# EAGLE design Schemat1 (EAGLE 9.6.2)
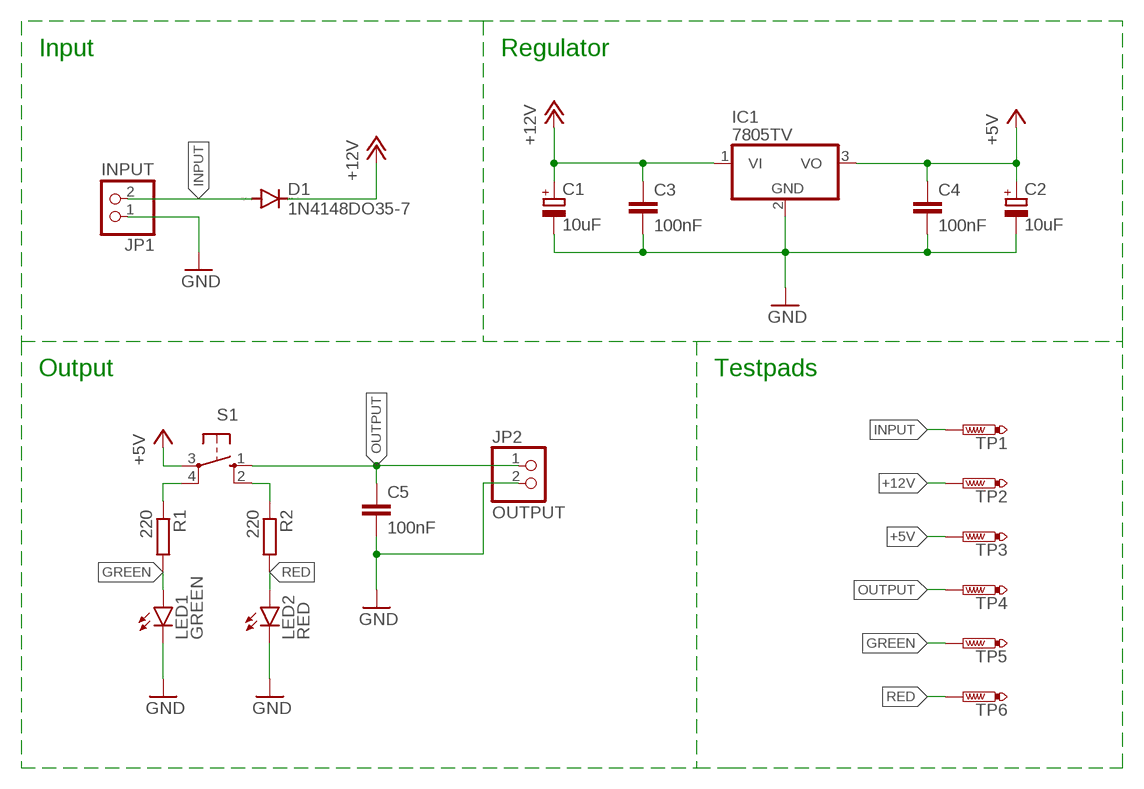
[diagram p0: schematic, sheet 1]

## Parts
C1  10uF  CPOL-EUD  [PANASONIC_D]
C2  10uF  CPOL-EUD  [PANASONIC_D]
C3  100nF  C-EU025-025X050  [C025-025X050]
C4  100nF  C-EU025-025X050  [C025-025X050]
C5  100nF  C-EU025-025X050  [C025-025X050]
D1  1N4148DO35-7  [DO35-7]
IC1  7805TV  [TO220V]
JP1  INPUT  PINHD-1X2  [1X02]
JP2  OUTPUT  PINHD-1X2  [1X02]
LED1  GREEN  LED5MM  [LED5MM]
LED2  RED  LED5MM  [LED5MM]
R1  220  R-EU_0207/10  [0207/10]
R2  220  R-EU_0207/10  [0207/10]
S1  10-XX  [B3F-10XX]
TP1  PTR1TP15R  [TP15R]
TP2  PTR1TP15R  [TP15R]
TP3  PTR1TP15R  [TP15R]
TP4  PTR1TP15R  [TP15R]
TP5  PTR1TP15R  [TP15R]
TP6  PTR1TP15R  [TP15R]

## Nets
+5V: C2.+ C4.1 IC1.3(VO) S1.3(P) TP3.TP
+12V: C1.+ C3.1 D1.C IC1.1(VI) TP2.TP
GND: C1.- C2.- C3.2 C4.2 C5.2 IC1.2(GND) JP1.1 JP2.2 LED1.K(C) LED2.K(C)
GREEN: LED1.A R1.2 TP5.TP
INPUT: D1.A JP1.2 TP1.TP
N$2: R1.1 S1.4(P1)
N$3: R2.1 S1.2(S1)
OUTPUT: C5.1 JP2.1 S1.1(S) TP4.TP
RED: LED2.A R2.2 TP6.TP

## Notes on the sheet
- Input | Regulator
- Output | Testpads

## Library data of the parts
C1 C2 = rcl:CPOL-EU: POLARIZED CAPACITOR, European symbol; SPICEPREFIX: C
C3-C5 = rcl:C-EU: CAPACITOR, European symbol; SPICEPREFIX: C
D1 = diode:1N4148: DIODE high speed (Philips)
IC1 = linear:78*: Positive VOLTAGE REGULATOR Source: http://cache.national.com/ds/LM/LM78L05.pdf http://www.fairchildsemi.com/ds/LM/LM7805.pdf
JP1 JP2 = pinhead:PINHD-1X2: PIN HEADER
LED1 LED2 = led:LED: LED OSRAM: - CHIPLED LG R971, LG N971, LY N971, LG Q971, LY Q971, LO R971, LY R971 LH N974, LH R974 LS Q976, LO Q976, LY Q976 LO Q996 - Hyper CHIPLED LW Q18S LB Q993, LB Q99A, LB R99A - SideLED LS A670, LO A670, LY A670, LG A670, LP A670 LB A673, LV A673, LT A673, LW A673 LH A674 LY A675 LS A676, LA A676, LO A676, LY A676, LW A676 LS A679, LY A679, LG A679 - Hyper Micro SIDELED® LS Y876, LA Y876, LO Y876, LY Y876 LT Y87S - SmartLED LW L88C, LW L88S LB L89C, LB L89S, LG L890 LS L89K, LO L89K, LY L89K LS L896, LA L896, LO L896, LY L896 - TOPLED LS T670, LO T670, LY T670, LG T670, LP T670 LSG T670, LSP T670, LSY T670, LOP T670, LYG T670 LG T671, LOG T671, LSG T671 LB T673, LV T673, LT T673, LW T673 LH T674 LS T676, LA T676, LO T676, LY T676, LB T676, LH T676, LSB T676, LW T676 LB T67C, LV T67C, LT T67C, LS T67K, LO T67K, LY T67K, LW E67C LS E67B, LA E67B, LO E67B, LY E67B, LB E67C, LV E67C, LT E67C LW T67C LS T679, LY T679, LG T679 LS T770, LO T770, LY T770, LG T770, LP T770 LB T773, LV T773, LT T773, LW T773 LH T774 LS E675, LA E675, LY E675, LS T675 LS T776, LA T776, LO T776, LY T776, LB T776 LHGB T686 LT T68C, LB T68C - Hyper Mini TOPLED® LB M676 - Mini TOPLED Santana® LG M470 LS M47K, LO M47K, LY M47K Source: http://www.osram.convergy.de LUXEON: - LUMILED® LXK2-PW12-R00, LXK2-PW12-S00, LXK2-PW14-U00, LXK2-PW14-V00 LXK2-PM12-R00, LXK2-PM12-S00, LXK2-PM14-U00 LXK2-PE12-Q00, LXK2-PE12-R00, LXK2-PE12-S00, LXK2-PE14-T00, LXK2-PE14-U00 LXK2-PB12-K00, LXK2-PB12-L00, LXK2-PB12-M00, LXK2-PB14-N00, LXK2-PB14-P00, LXK2-PB14-Q00 LXK2-PR12-L00, LXK2-PR12-M00, LXK2-PR14-Q00, LXK2-PR14-R00 LXK2-PD12-Q00, LXK2-PD12-R00, LXK2-PD12-S00 LXK2-PH12-R00, LXK2-PH12-S00 LXK2-PL12-P00, LXK2-PL12-Q00, LXK2-PL12-R00 Source: www.luxeon.com KINGBRIGHT: KA-3528ASYC Source: www.kingbright.com
R1 R2 = rcl:R-EU_: RESISTOR, European symbol; SPICEPREFIX: R
S1 = switch-omron:10-XX: OMRON SWITCH; MPN: B3F-1000; OC_FARNELL: 176432; OC_NEWARK: 36M3542
TP1-TP6 = testpad:PTR1: TEST PIN

## Board
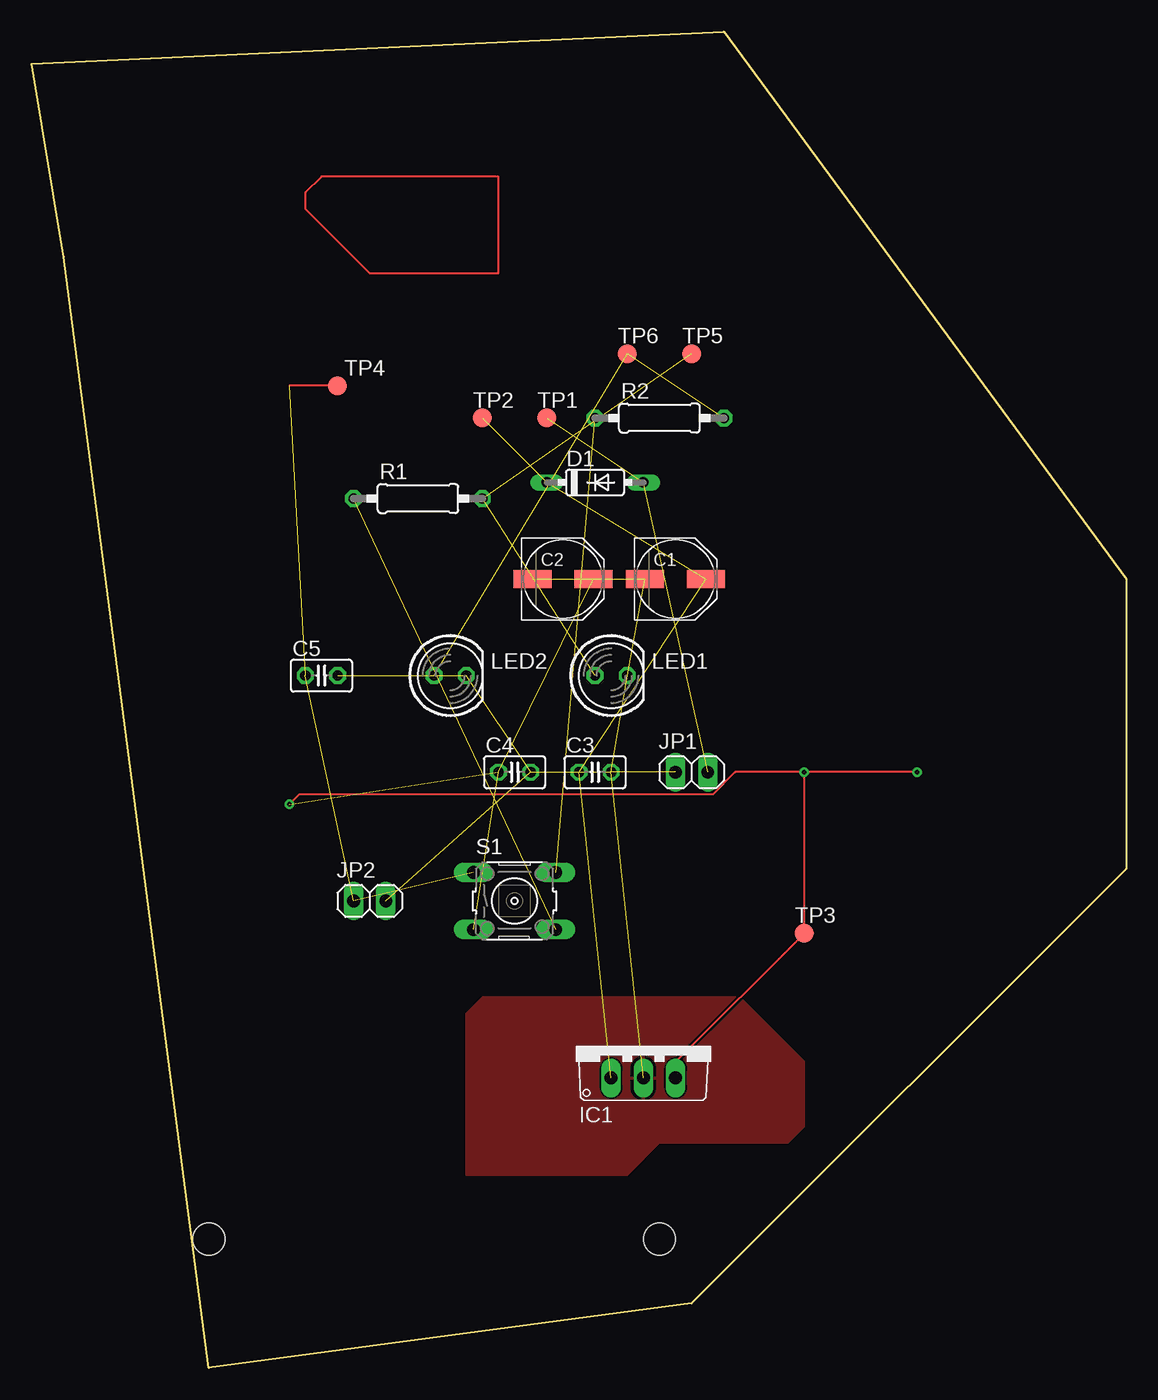
[diagram p1: board, top side]
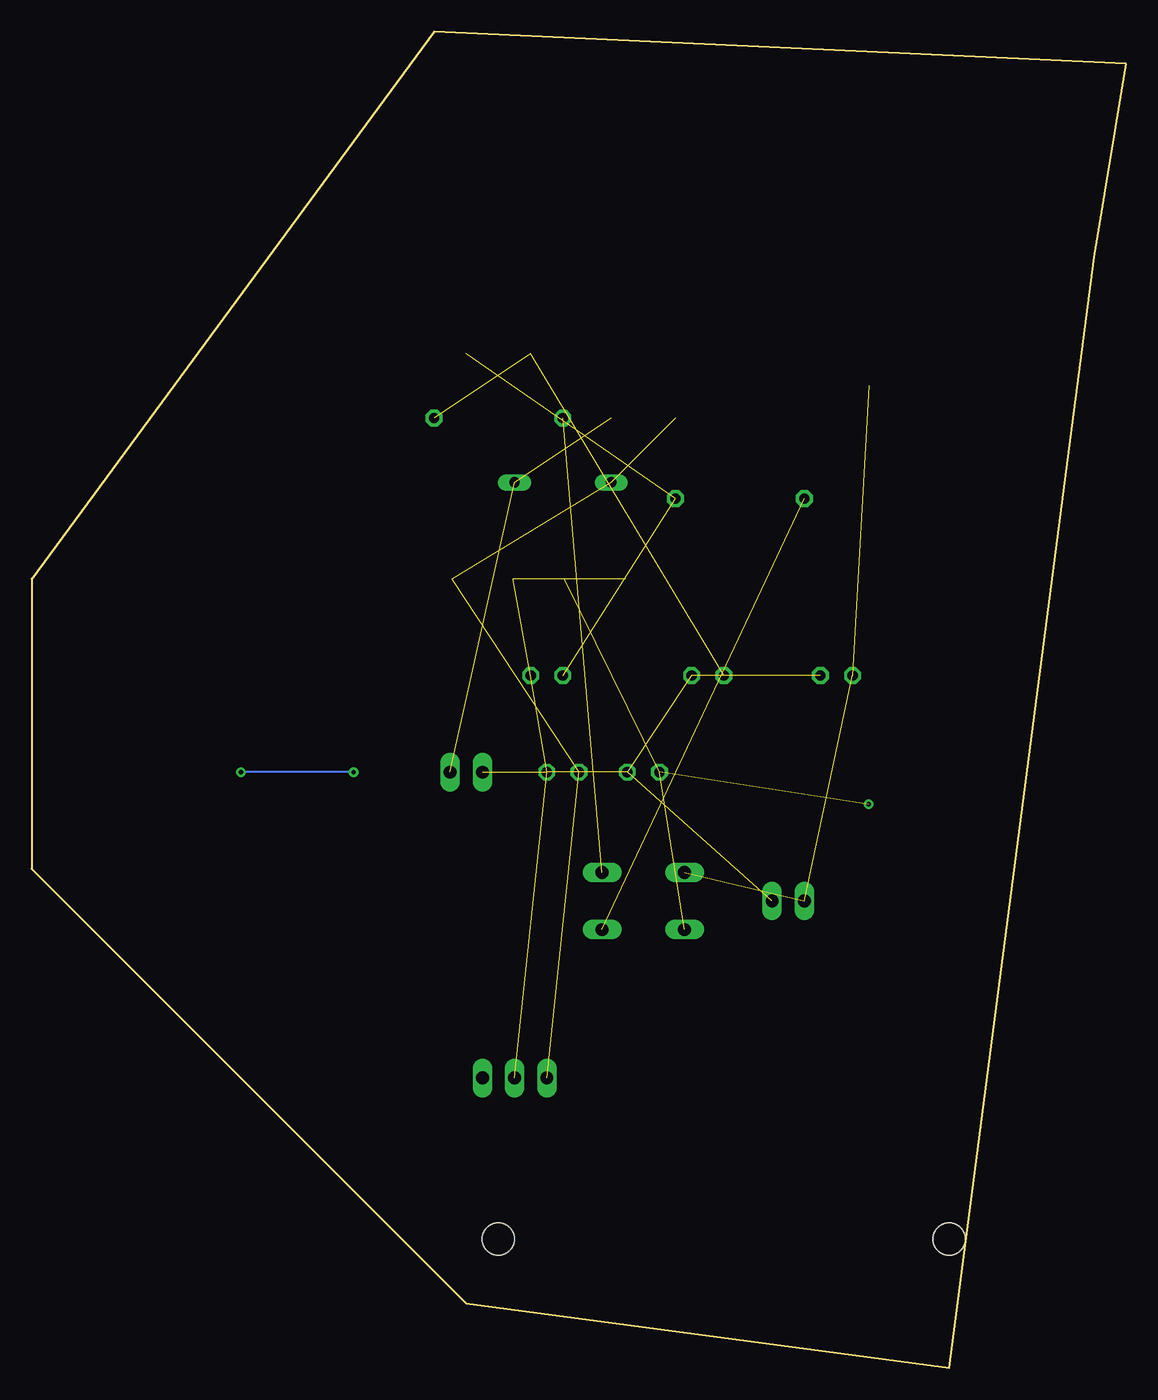
[diagram p2: board, bottom side, seen from below]

Size 86.36 x 105.41 mm. Coordinates in mm from the lower left corner, seen from the top.
Outline: 0,102.87 54.61,105.41 86.36,62.23 86.36,39.37 52.07,5.08 13.97,0 2.54,87.63 0,102.87
Copper layers (1*16): Top 0.035mm / dielectric 1.5mm / Bottom 0.035mm
Design rules "default": minimum track width 6mil, minimum drill 0.35mm, track to track 6mil, track to pad 6mil, pad to pad 6mil, via to via 6mil, smd to smd 6mil, copper to edge 40mil, drill to drill 6mil, minimum pad ring 10mil, minimum via ring 8mil, stop-mask expansion 4mil, vias tented up to drill 0mil, thermal gap 10mil
Holes 2.54 mm at 13.97,10.16 49.53,10.16
tRestrict: 7 lines

### Footprints (pad centres in the part's own frame; a part is rotated, then mirrored left to right if it is on the bottom)
PANASONIC_D = smd 3 x 1.4: + 2.4,0; - -2.4,0
C025-025X050 = drill 0.813 octagon: 1 -1.27,0; 2 1.27,0
DO35-7 = drill 0.813 long: A 3.81,0; C -3.81,0
TO220V = drill 1.016 long: 1 -2.54,-2.54; 2 0,-2.54; 3 2.54,-2.54
1X02 = drill 1.016 long: 1 -1.27,0; 2 1.27,0
LED5MM = drill 0.813 octagon: A -1.27,0; K 1.27,0
0207/10 = drill 0.813 octagon: 1 -5.08,0; 2 5.08,0
B3F-10XX = drill 1.016 long: 1 -3.251,2.261; 2 3.251,2.261; 3 -3.251,-2.261; 4 3.251,-2.261
TP15R = smd 1.5 x 1.5: TP 0,0

### Placement (x,y rotation side)
C1  50.8,62.23 0 top
C2  41.91,62.23 0 top
C3  44.45,46.99 0 top
C4  38.1,46.99 0 top
C5  22.86,54.61 0 top
D1  44.45,69.85 0 top
IC1  48.26,25.4 0 top
JP1  52.07,46.99 0 top
JP2  26.67,36.83 0 top
LED1  45.72,54.61 0 top
LED2  33.02,54.61 0 top
R1  30.48,68.58 0 top
R2  49.53,74.93 0 top
S1  38.1,36.83 0 top
TP1  40.64,74.93 0 top
TP2  35.56,74.93 0 top
TP3  60.96,34.29 0 top
TP4  24.13,77.47 0 top
TP5  52.07,80.01 0 top
TP6  46.99,80.01 0 top

### Tracks (layer width: path | path; a pad name or v marks a point on that pad's centre or on a via)
+5V  (via drill 0.35)  (3 unrouted)
  Top 0.152: IC1.3 50.8,24.13 TP3.TP v60.96,46.99 | v69.85,46.99 55.5,46.99 53.75,45.24 21.11,45.24 v20.32,44.45
  Bottom 0.152: v60.96,46.99 v69.85,46.99
+12V  (4 unrouted)
GND  (9 unrouted)
  pour Top: 35.56,29.21 34.29,27.94 34.29,15.24 46.99,15.24 49.53,17.78 59.69,17.78 60.96,19.05 60.96,24.13 55.88,29.21 52.07,29.21
GREEN  (2 unrouted)
INPUT  (2 unrouted)
N$1
  Top 0.152: 21.59,91.44 26.67,86.36 36.83,86.36 36.83,93.98 22.86,93.98 21.59,92.71 21.59,91.44
N$2  (1 unrouted)
N$3  (1 unrouted)
OUTPUT  (3 unrouted)
  Top 0.152: TP4.TP 20.32,77.47
RED  (2 unrouted)